# EAGLE design bldc-interface (EAGLE 6.2)
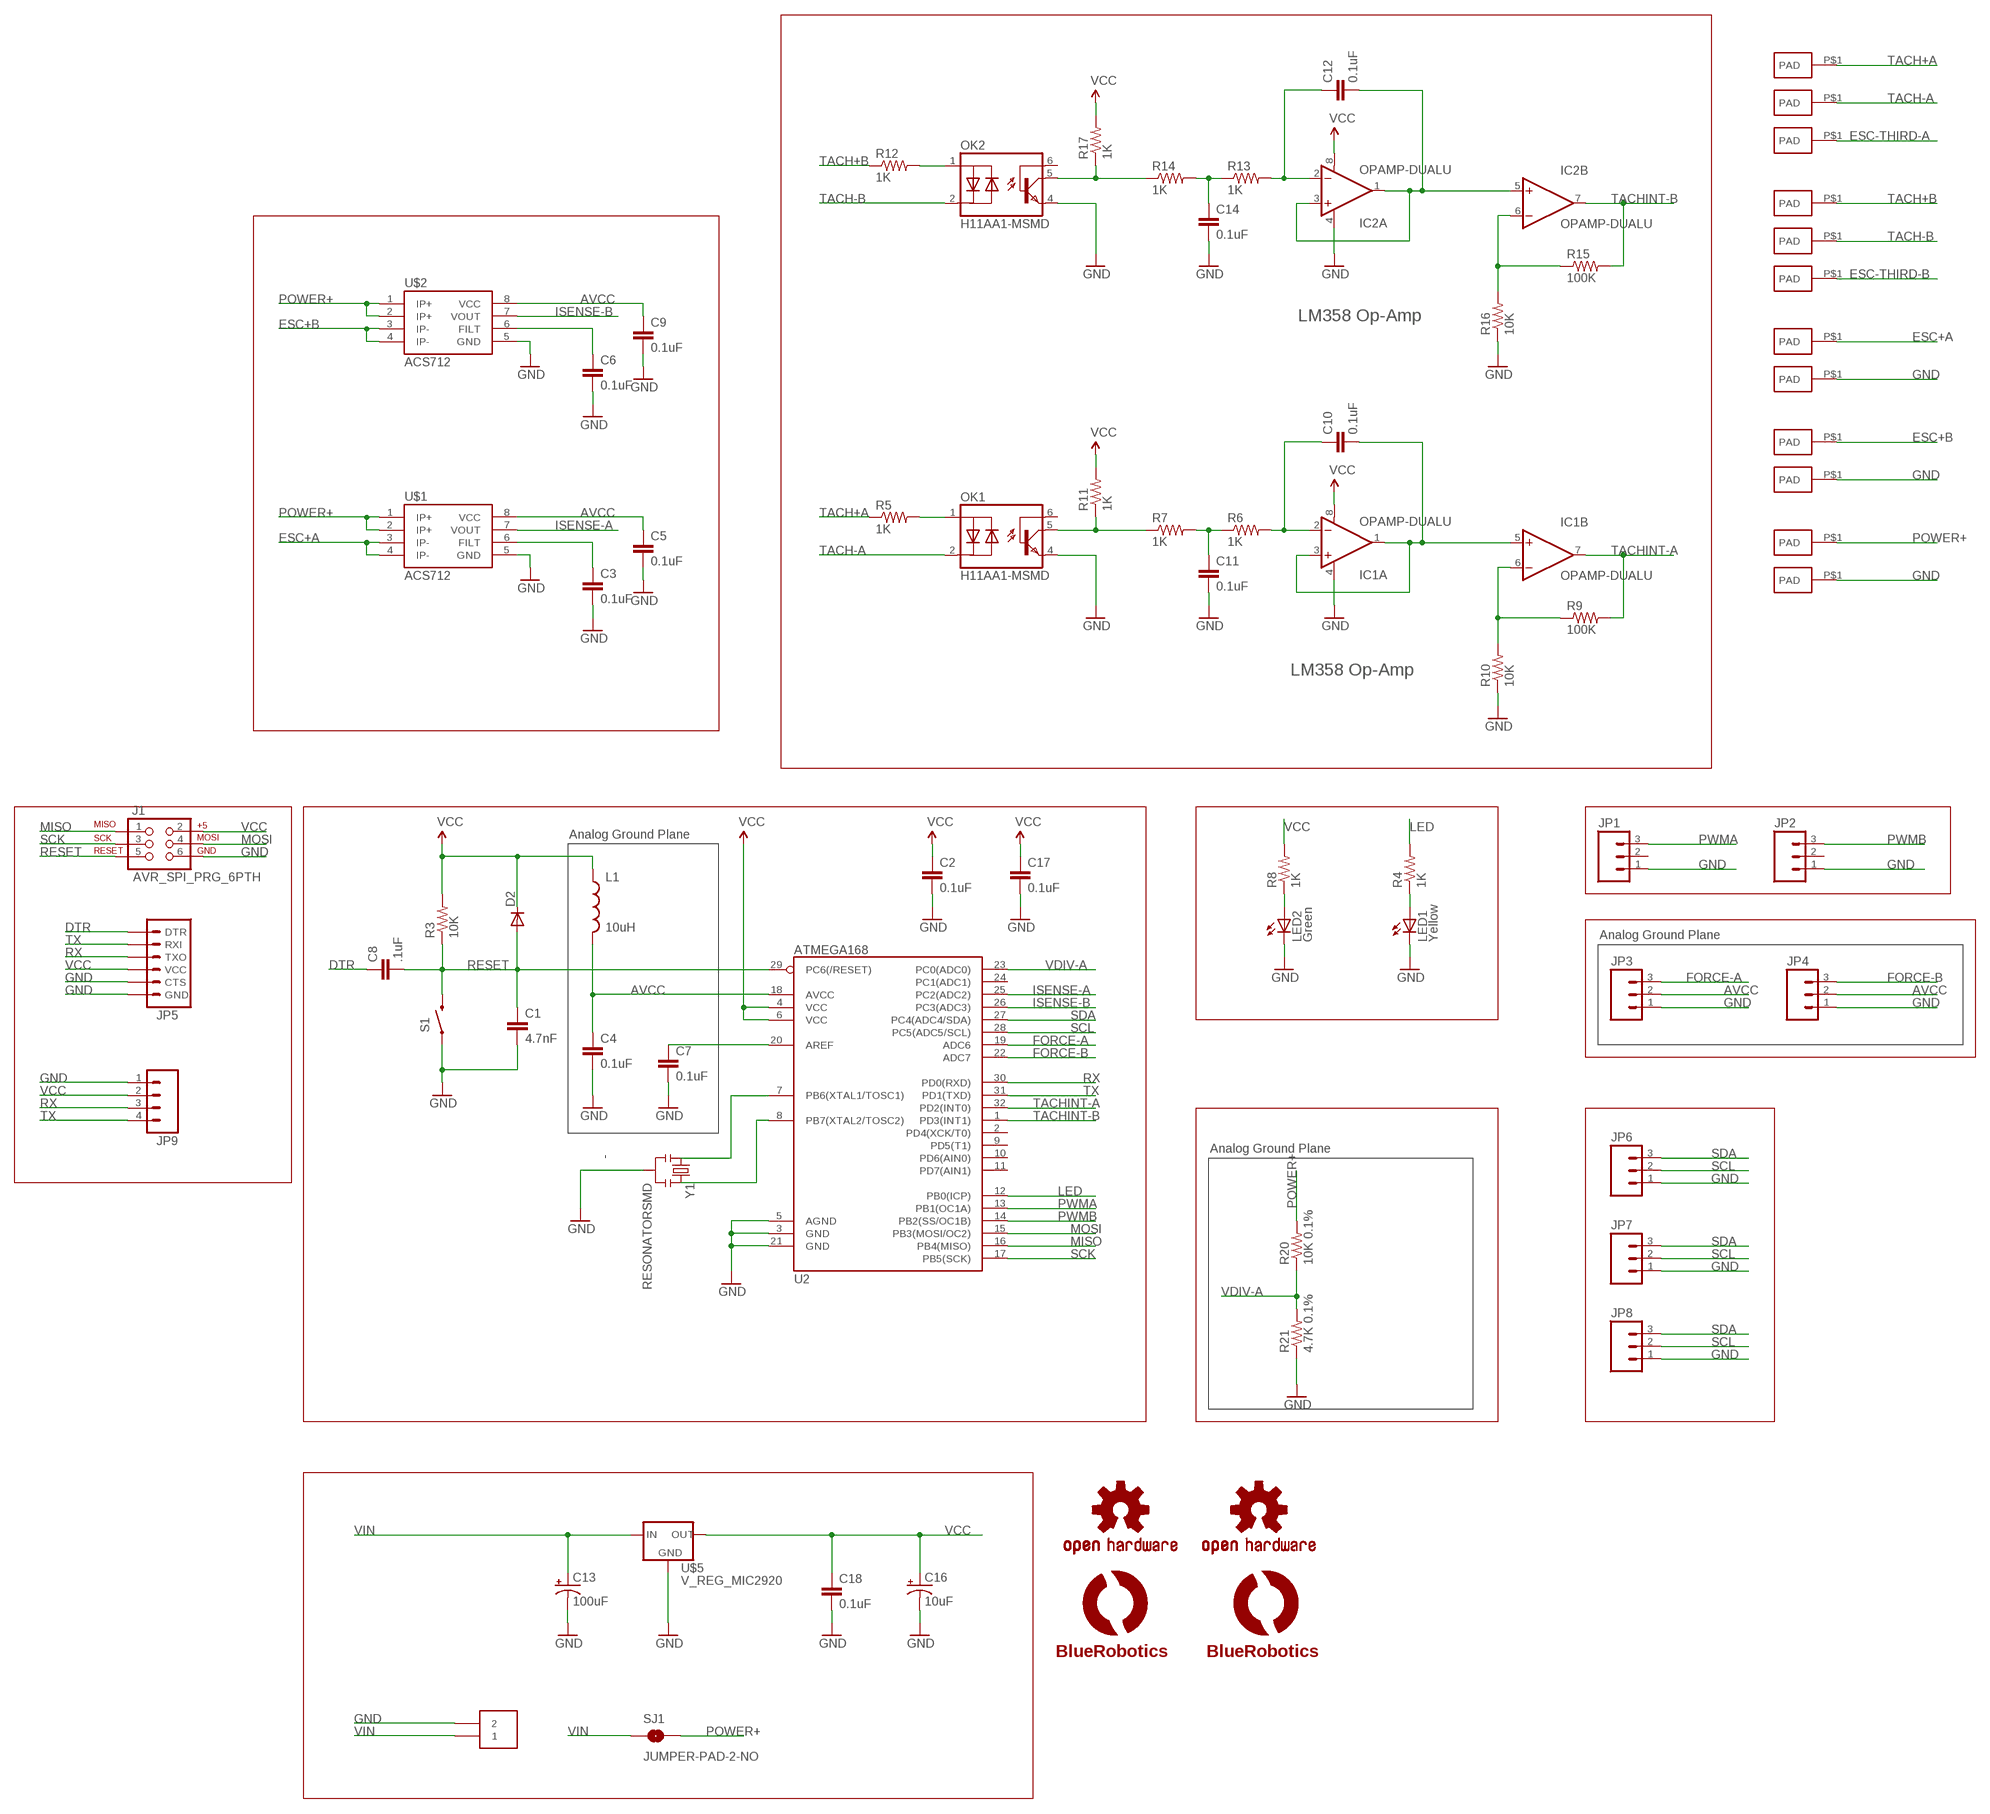
[diagram p0: schematic, sheet 1]

## Parts
C1  4.7nF  CAP0603-CAP  [0603-CAP]
C2  0.1uF  CAP0603-CAP  [0603-CAP]
C3  0.1uF  CAP0603-CAP  [0603-CAP]
C4  0.1uF  CAP0603-CAP  [0603-CAP]
C5  0.1uF  CAP0603-CAP  [0603-CAP]
C6  0.1uF  CAP0603-CAP  [0603-CAP]
C7  0.1uF  CAP0603-CAP  [0603-CAP]
C8  .1uF  CAP0603-CAP  [0603-CAP]
C9  0.1uF  CAP0603-CAP  [0603-CAP]
C10  0.1uF  CAP0603-CAP  [0603-CAP]
C11  0.1uF  CAP0603-CAP  [0603-CAP]
C12  0.1uF  CAP0603-CAP  [0603-CAP]
C13  100uF  CAP_POLPTH1  [CPOL-RADIAL-100UF-25V]
C14  0.1uF  CAP0603-CAP  [0603-CAP]
C16  10uF  CAP_POL1206  [EIA3216]
C17  0.1uF  CAP0603-CAP  [0603-CAP]
C18  0.1uF  CAP0603-CAP  [0603-CAP]
D2  DIODESOD  [SOD-323]
IC1  OPAMP-DUALU  [SO08]
IC2  OPAMP-DUALU  [SO08]
J1  AVR_SPI_PRG_6PTH  [2X3]
JP1  M03PTH  [1X03]
JP2  M03PTH  [1X03]
JP3  M03PTH  [1X03]
JP4  M03PTH  [1X03]
JP5  ARDUINO_SERIAL_PROGRAMPTH  [1X06]
JP6  M03PTH  [1X03]
JP7  M03PTH  [1X03]
JP8  M03PTH  [1X03]
JP9  M04PTH  [1X04]
L1  10uH  INDUCTOR0603  [0603]
LED1  Yellow  LED0603  [LED-0603]
LED2  Green  LED0603  [LED-0603]
LOGO1  OSHW-LOGOS  [OSHW-LOGO-S]
LOGO2  OSHW-LOGOM  [OSHW-LOGO-M]
OK1  H11AA1-MSMD  [DIL6-SMD]
OK2  H11AA1-MSMD  [DIL6-SMD]
R3  10K  RESISTOR0603-RES  [0603-RES]
R4  1K  RESISTOR0603-RES  [0603-RES]
R5  1K  RESISTOR2512  [R2512]
R6  1K  RESISTOR0603-RES  [0603-RES]
R7  1K  RESISTOR0603-RES  [0603-RES]
R8  1K  RESISTOR0603-RES  [0603-RES]
R9  100K  RESISTOR0603-RES  [0603-RES]
R10  10K  RESISTOR0603-RES  [0603-RES]
R11  1K  RESISTOR0603-RES  [0603-RES]
R12  1K  RESISTOR2512  [R2512]
R13  1K  RESISTOR0603-RES  [0603-RES]
R14  1K  RESISTOR0603-RES  [0603-RES]
R15  100K  RESISTOR0603-RES  [0603-RES]
R16  10K  RESISTOR0603-RES  [0603-RES]
R17  1K  RESISTOR0603-RES  [0603-RES]
R20  10K 0.1%  RESISTOR0603-RES  [0603-RES]
R21  4.7K 0.1%  RESISTOR0603-RES  [0603-RES]
S1  reset  SWITCH-MOMENTARY-2SMD  [TACTILE_SWITCH_SMD]
SJ1  JUMPER-PAD-2-NO  [PAD-JUMPER-2-NO_NO_SILK]
U2  ATMEGA168  [TQFP32-08]
U$1  ACS712  [SO08]
U$2  ACS712  [SO08]
U$3  TERMINAL-25MM-WEID  [LSF-SMT-5MM-2]
U$4  PADLARGE-ONE-SIDE  [PAD-0.2X0.3-ONE-SIDE]
U$5  V_REG_MIC2920  [SOT223]
U$6  PADLARGE-ONE-SIDE  [PAD-0.2X0.3-ONE-SIDE]
U$7  PADLARGE-ONE-SIDE  [PAD-0.2X0.3-ONE-SIDE]
U$8  PADLARGE-ONE-SIDE  [PAD-0.2X0.3-ONE-SIDE]
U$9  PADLARGE-ONE-SIDE  [PAD-0.2X0.3-ONE-SIDE]
U$10  PADLARGE-ONE-SIDE  [PAD-0.2X0.3-ONE-SIDE]
U$11  PADLARGE-ONE-SIDE  [PAD-0.2X0.3-ONE-SIDE]
U$12  PADLARGE-ONE-SIDE  [PAD-0.2X0.3-ONE-SIDE]
U$13  PADLARGE-ONE-SIDE  [PAD-0.2X0.3-ONE-SIDE]
U$14  PADLARGE-ONE-SIDE  [PAD-0.2X0.3-ONE-SIDE]
U$15  PADLARGE-ONE-SIDE  [PAD-0.2X0.3-ONE-SIDE]
U$16  PADLARGE-ONE-SIDE  [PAD-0.2X0.3-ONE-SIDE]
U$17  LOGOBR-LOGO-M  [BR-LOGO-MEDIUM]
U$18  LOGOBR-LOGO-S  [BR-LOGO-SMALL]
Y1  RESONATORSMD  [RESONATOR-SMD]

## Nets
AVCC: C4.1 C5.1 C9.1 JP3.2 JP4.2 L1.2 U2.18(AVCC) U$1.8(VCC) U$2.8(VCC)
DTR: C8.1 JP5.1(DTR)
ESC+A: U$1.3(IP-) U$1.4(IP-) U$13.P$1(PAD)
ESC+B: U$2.3(IP-) U$2.4(IP-) U$15.P$1(PAD)
ESC-THIRD-A: U$9.P$1(PAD)
ESC-THIRD-B: U$12.P$1(PAD)
FORCE-A: JP3.3 U2.19(ADC6)
FORCE-B: JP4.3 U2.22(ADC7)
GND: C1.2 C2.2 C3.2 C4.2 C5.2 C6.2 C7.2 C9.2 C11.2 C13.2(-) C14.2 C16.C(-) C17.2 C18.2 IC1.4(A:V-) IC2.4(A:V-) J1.6 JP1.1 JP2.1 JP3.1 JP4.1 JP5.5(CTS) JP5.6(GND) JP6.1 JP7.1 JP8.1 JP9.1 LED1.C LED2.C OK1.4(EMI) OK2.4(EMI) R10.1 R16.1 R21.1 S1.1 U2.3(GND) U2.5(AGND) U2.21(GND) U$1.5(GND) U$2.5(GND) U$3.2 U$3.4 U$5.2(GND) U$8.P$1(PAD) U$14.P$1(PAD) U$16.P$1(PAD) Y1.2
ISENSE-A: U2.25(PC2(ADC2)) U$1.7(VOUT)
ISENSE-B: U2.26(PC3(ADC3)) U$2.7(VOUT)
LED: R4.2 U2.12(PB0(ICP))
MISO: J1.1 U2.16(PB4(MISO))
MOSI: J1.4 U2.15(PB3(MOSI/OC2))
N$1: C6.1 U$2.6(FILT)
N$2: C3.1 U$1.6(FILT)
N$3: LED1.A R4.1
N$4: C10.1 IC1.2(A:-IN) R6.2
N$6: C10.2 IC1.1(A:OUT) IC1.3(A:+IN) IC1.5(B:+IN)
N$7: IC1.6(B:-IN) R9.1 R10.2
N$8: C11.1 R6.1 R7.2
N$9: C7.1 U2.20(AREF)
N$10: U2.7(PB6(XTAL1/TOSC1)) Y1.1
N$11: U2.8(PB7(XTAL2/TOSC2)) Y1.3
N$12: OK1.5(COL) R7.1 R11.1
N$13: C12.1 IC2.2(A:-IN) R13.2
N$14: OK1.1(A) R5.2
N$15: C12.2 IC2.1(A:OUT) IC2.3(A:+IN) IC2.5(B:+IN)
N$16: LED2.A R8.1
N$17: C14.1 R13.1 R14.2
N$18: IC2.6(B:-IN) R15.1 R16.2
N$19: OK2.1(A) R12.2
N$20: OK2.5(COL) R14.1 R17.1
POWER+: R20.2 SJ1.2 U$1.1(IP+) U$1.2(IP+) U$2.1(IP+) U$2.2(IP+) U$7.P$1(PAD)
PWMA: JP1.3 U2.13(PB1(OC1A))
PWMB: JP2.3 U2.14(PB2(SS/OC1B))
RESET: C1.1 C8.2 D2.2(A) J1.5 R3.1 S1.3 U2.29(PC6(/RESET))
RX: JP5.3(TXO) JP9.3 U2.30(PD0(RXD))
SCK: J1.3 U2.17(PB5(SCK))
SCL: JP6.2 JP7.2 JP8.2 U2.28(PC5(ADC5/SCL))
SDA: JP6.3 JP7.3 JP8.3 U2.27(PC4(ADC4/SDA))
TACH+A: R5.1 U$6.P$1(PAD)
TACH+B: R12.1 U$10.P$1(PAD)
TACH-A: OK1.2(C) U$4.P$1(PAD)
TACH-B: OK2.2(C) U$11.P$1(PAD)
TACHINT-A: IC1.7(B:OUT) R9.2 U2.32(PD2(INT0))
TACHINT-B: IC2.7(B:OUT) R15.2 U2.1(PD3(INT1))
TX: JP5.2(RXI) JP9.4 U2.31(PD1(TXD))
VCC: C2.1 C16.A(+) C17.1 C18.1 D2.1(C) IC1.8(A:V+) IC2.8(A:V+) J1.2 JP5.4(VCC) JP9.2 L1.1 R3.2 R8.2 R11.2 R17.2 U2.4(VCC) U2.6(VCC) U$5.3(OUT)
VDIV-A: R20.1 R21.2 U2.23(PC0(ADC0))
VIN: C13.1(+) SJ1.1 U$3.1 U$3.3 U$5.1(IN)
Unconnected: JP1.2 JP2.2 OK1.6(BAS) OK2.6(BAS) U2.2(PD4(XCK/T0)) U2.9(PD5(T1)) U2.10(PD6(AIN0)) U2.11(PD7(AIN1)) U2.24(PC1(ADC1))

## Notes on the sheet
- LM358 Op-Amp
- LM358 Op-Amp
- Analog Ground Plane
- Analog Ground Plane
- Analog Ground Plane

## Library data of the parts
C1 C4 C7 C8 C18 = SparkFun:CAP: Capacitor Standard 0603 ceramic capacitor, and 0.1" leaded capacitor.
C2 C17 = SparkFun2:CAP: Capacitor Standard 0603 ceramic capacitor, and 0.1" leaded capacitor.
C3 C5 C6 C9-C12 C14 = SparkFun-Capacitors:CAP: Capacitor Standard 0603 ceramic capacitor, and 0.1" leaded capacitor.
C13 C16 = SparkFun:CAP_POL: Capacitor Polarized These are standard SMD and PTH capacitors. Normally 10uF, 47uF, and 100uF in electrolytic and tantalum varieties. Always verify the external diameter of the through hole cap, it varies with capacity, voltage, and manufacturer. The EIA devices should be standard.
D2 = SparkFun:DIODE: Diode These are standard reverse protection diodes and small signal diodes. SMA package can handle up to about 1A. SOD-323 can handle about 200mA. What the SOD-323 package when ordering, there are some mfgs out there that are 5-pin packages.
IC1 IC2 = SparkFun-AnalogIC:OPAMP-DUAL: Generic op-amp footprint
J1 = SparkFun:AVR_SPI_PRG_6: AVR ISP 6 Pin This is the reduced ISP connector for AVR programming. Common on Arduino. This footprint will take up less PCB space and can be used with a 10-pin to 6-pin adapter such as SKU: BOB-08508
JP1-JP4 JP6-JP8 = SparkFun:M03: Header 3 Standard 3-pin 0.1" header. Use with straight break away headers (SKU : PRT-00116), right angle break away headers (PRT-00553), swiss pins (PRT-00743), machine pins (PRT-00117), and female headers (PRT-00115). Molex polarized connector foot print use with SKU : PRT-08232 with associated crimp pins and housings.
JP5 = SparkFun:ARDUINO_SERIAL_PROGRAM
JP9 = SparkFun-Connectors:M04: Header 4 Standard 4-pin 0.1" header. Use with straight break away headers (SKU : PRT-00116), right angle break away headers (PRT-00553), swiss pins (PRT-00743), machine pins (PRT-00117), and female headers (PRT-00115). Molex polarized connector foot print use with SKU : PRT-08231 with associated crimp pins and housings. 1MM SMD Version SKU: PRT-10208
L1 = SparkFun:INDUCTOR: Inductors Basic Inductor/Choke - 0603 and 1206. Footprints are not proven and vary greatly between part numbers.
LED1 LED2 = SparkFun:LED: LEDs Standard schematic elements and footprints for 5mm, 3mm, 1206, and 0603 sized LEDs. 5mm - Spark Fun Electronics SKU : COM-00529 (and others)
LOGO1 LOGO2 = SparkFun-Aesthetics:OSHW-LOGO: Open Source Hardware Logo This logo indicates the piece of hardware it is found on incorporates a OSHW license and/or adheres to the definition of open source hardware found here: http://freedomdefined.org/OSHW
OK1 OK2 = AT-Parts-RJ:H11AA1-M: MOTOROLA OPTO COUPLER
R3 R4 R8 R20 R21 = SparkFun:RESISTOR: Resistor Basic schematic elements and footprints for 0603, 1206, and PTH resistors.
R5-R7 R9-R17 = SparkFun-Resistors:RESISTOR: Resistor Basic schematic elements and footprints for 0603, 1206, and PTH resistors.
S1 = SparkFun:SWITCH-MOMENTARY-2
SJ1 = SparkFun-Passives:JUMPER-PAD-2-NO
U2 = SparkFun:ATMEGA168
U$1 U$2 = SparkFun-AnalogIC:ACS712: Hall-effect-based isolated linear current sensor
U$3 = AT-Parts-RJ:TERMINAL-2
U$4 U$6-U$16 = AT-Parts-RJ:PAD
U$5 = SparkFun:V_REG_MIC2920: MIC2920A (http://www.micrel.com/_PDF/mic2920.pdf) - 400mA output LDO Regulator
U$17 U$18 = BR-Eagle-Library:LOGO
Y1 = SparkFun:RESONATOR: Resonator Small SMD resonator. This is the itty bitty 10/20MHz resonators with built in caps. CSTCE10M0G55 and CSTCE20M0V53. Footprint has been reviewed closely but hasn't been tested yet.

## Board
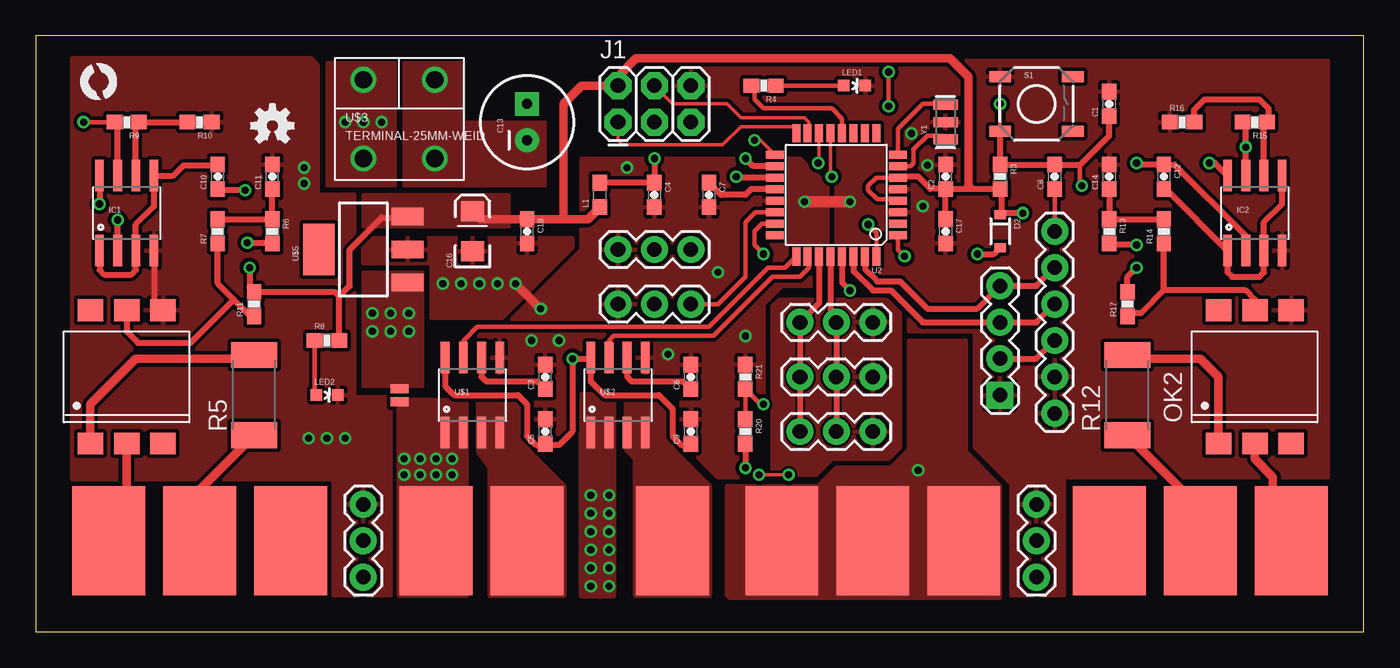
[diagram p1: board, top side]
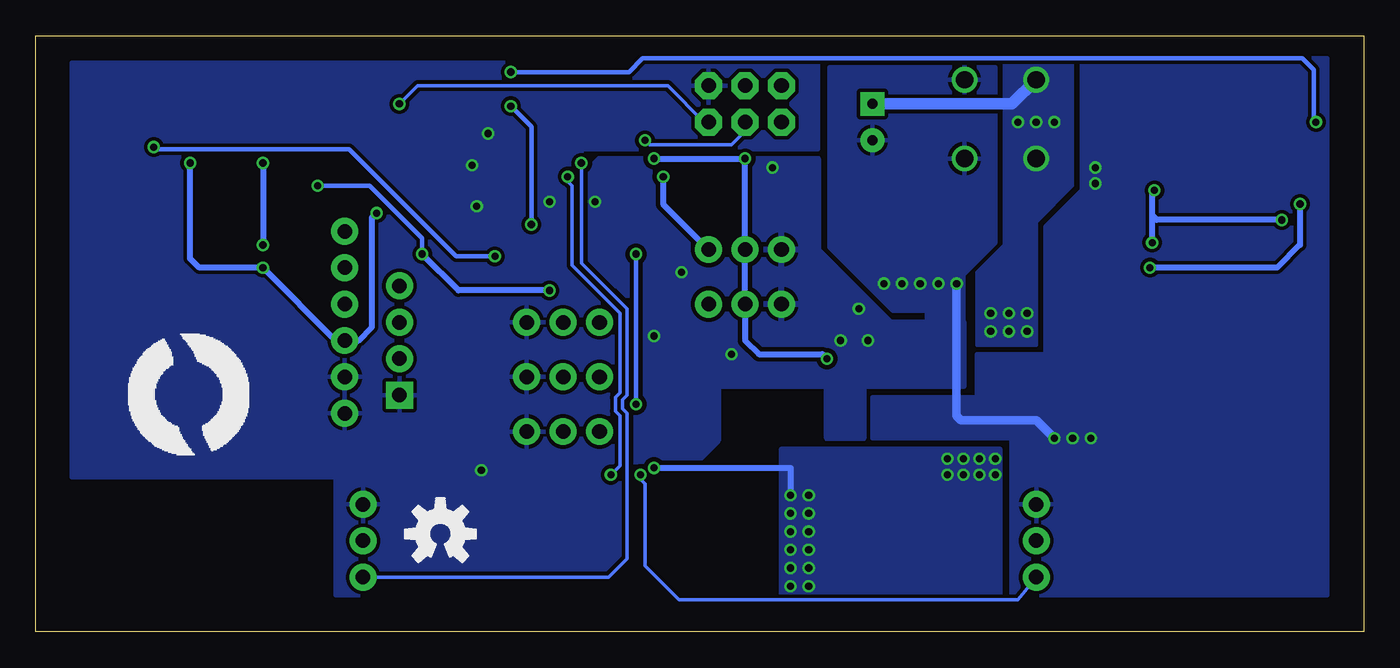
[diagram p2: board, bottom side, seen from below]

Size 92.69 x 41.58 mm. Coordinates in mm from the lower left corner, seen from the top.
Outline: 0,0 92.69,0 92.69,41.58 0,41.58 0,0
Copper layers (1*16): Top 0.0356mm / dielectric 1.5011mm / Bottom 0.0356mm
Design rules "default": minimum track width 6mil, minimum drill 13mil, track to track 6mil, track to pad 6mil, pad to pad 6mil, via to via 6mil, smd to smd 6mil, copper to edge 15mil, drill to drill 6mil, minimum pad ring 7mil, minimum via ring 7mil, stop-mask expansion 3mil, vias tented up to drill 0mil, thermal gap 10mil

### Footprints (pad centres in the part's own frame; a part is rotated, then mirrored left to right if it is on the bottom)
0603-CAP = smd 1.1 x 1: 1 -0.85,0; 2 0.85,0
CPOL-RADIAL-100UF-25V = drill 0.7 pad 1.651 square: 1 1.27,0 | drill 0.7 pad 1.651: 2 -1.27,0
EIA3216 = smd 1.4 x 1.6: A 1.4,0; C -1.4,0
SOD-323 = smd 0.63 x 0.83: 1 -1.15,0; 2 1.15,0
SO08 = smd 0.61 x 2.21: 1 -1.905,-2.616; 2 -0.635,-2.616; 3 0.635,-2.616; 4 1.905,-2.616; 5 1.905,2.616; 6 0.635,2.616; 7 -0.635,2.616; 8 -1.905,2.616
2X3 = drill 1.016 pad 1.88 octagon: 1 0,0; 2 0,2.54; 3 2.54,0; 4 2.54,2.54; 5 5.08,0; 6 5.08,2.54
1X03 = drill 1.016 pad 1.88: 1 0,0; 2 2.54,0; 3 5.08,0
1X06 = drill 1.016 pad 1.88: 1 0,0; 2 2.54,0; 3 5.08,0; 4 7.62,0; 5 10.16,0; 6 12.7,0
1X04 = drill 1.016 pad 1.88 square: 1 0,0 | drill 1.016 pad 1.88: 2 2.54,0; 3 5.08,0; 4 7.62,0
0603 = smd 1.1 x 1: 1 -0.85,0; 2 0.85,0
LED-0603 = smd 0.8 x 0.8: A 0,-0.75; C 0,0.75
DIL6-SMD = smd 1.78 x 1.52: 1 -2.54,-4.645; 2 0,-4.645; 3 2.54,-4.645; 4 2.54,4.645; 5 0,4.645; 6 -2.54,4.645
0603-RES = smd 1.1 x 1: 1 -0.85,0; 2 0.85,0
R2512 = smd 1.8 x 3.2: 1 -2.8,0; 2 2.8,0
TACTILE_SWITCH_SMD = smd 1.524 x 0.762: 1 -2.54,1.905; 2 2.54,1.905; 3 -2.54,-1.905; 4 2.54,-1.905
PAD-JUMPER-2-NO_NO_SILK = smd 0.635 x 1.27: 1 -0.45,0; 2 0.45,0
TQFP32-08 = smd 1.27 x 0.559: 1 -4.293,2.8; 2 -4.293,2; 3 -4.293,1.2; 4 -4.293,0.4; 5 -4.293,-0.4; 6 -4.293,-1.2; 7 -4.293,-2; 8 -4.293,-2.8; 17 4.293,-2.8; 18 4.293,-2; 19 4.293,-1.2; 20 4.293,-0.4; 21 4.293,0.4; 22 4.293,1.2; 23 4.293,2; 24 4.293,2.8 | smd 0.559 x 1.27: 9 -2.8,-4.293; 10 -2,-4.293; 11 -1.2,-4.293; 12 -0.4,-4.293; 13 0.4,-4.293; 14 1.2,-4.293; 15 2,-4.293; 16 2.8,-4.293; 25 2.8,4.293; 26 2,4.293; 27 1.2,4.293; 28 0.4,4.293; 29 -0.4,4.293; 30 -1.2,4.293; 31 -2,4.293; 32 -2.8,4.293
LSF-SMT-5MM-2 = drill 1.2: 1 0,0; 2 5,0; 3 0,5.5; 4 5,5.5
PAD-0.2X0.3-ONE-SIDE = smd 5.08 x 7.62: P$1 0,0
SOT223 = smd 1.219 x 2.235: 1 -2.311,-3.099; 2 0,-3.099; 3 2.311,-3.099 | smd 3.6 x 2.2: 4 0,3.099
RESONATOR-SMD = smd 0.7 x 1.7: 1 -1.2,0; 2 0,0; 3 1.2,0

### Placement (x,y rotation side)
C1  74.93,36.83 90 top
C2  63.5,31.75 90 top
C3  35.56,17.78 90 top
C4  43.18,30.48 270 top
C5  35.56,13.97 90 top
C6  45.72,17.78 90 top
C7  46.99,30.48 270 top
C8  71.12,31.75 90 top
C9  45.72,13.97 90 top
C10  12.7,31.75 90 top
C11  16.51,31.75 90 top
C12  78.74,31.75 270 top
C13  34.29,35.56 90 top
C14  74.93,31.75 90 top
C16  30.48,27.94 90 top
C17  63.5,27.94 270 top
C18  34.29,27.94 270 top
D2  67.31,27.94 270 top
IC1  6.35,29.21 0 top
IC2  85.09,29.21 0 top
J1  40.64,35.56 0 top
JP1  22.86,8.89 270 top
JP2  69.85,8.89 270 top
JP3  40.64,26.67 0 top
JP4  40.64,22.86 0 top
JP5  71.12,27.94 270 top
JP6  58.42,21.59 180 top
JP7  58.42,17.78 180 top
JP8  58.42,13.97 180 top
JP9  67.31,16.51 90 top
L1  39.37,30.48 90 top
LED1  57.15,38.1 270 top
LED2  20.32,16.51 270 top
LOGO1  16.52,35.31 0 top
LOGO2  64.45,6.83 0 bottom
OK1  6.35,17.78 0 top
OK2  85.09,17.78 0 top
R3  67.31,31.75 270 top
R4  50.8,38.1 180 top
R5  15.24,16.51 90 top
R6  16.51,27.94 270 top
R7  12.7,27.94 90 top
R8  20.32,20.32 0 top
R9  6.35,35.56 180 top
R10  11.43,35.56 180 top
R11  15.24,22.86 90 top
R12  76.2,16.51 90 top
R13  74.93,27.94 270 top
R14  78.74,27.94 90 top
R15  85.09,35.56 180 top
R16  80.01,35.56 0 top
R17  76.2,22.86 90 top
R20  49.53,13.97 270 top
R21  49.53,17.78 270 top
S1  69.85,36.83 0 top
SJ1  25.4,16.51 270 top
U2  55.88,30.48 180 top
U$1  30.48,16.51 0 top
U$2  40.64,16.51 0 top
U$3  22.86,33.02 0 top
U$4  5.08,6.35 0 top
U$5  22.86,26.67 90 top
U$6  11.43,6.35 0 top
U$7  27.94,6.35 0 top
U$8  52.07,6.35 0 top
U$9  17.78,6.35 180 top
U$10  81.28,6.35 180 top
U$11  87.63,6.35 180 top
U$12  74.93,6.35 180 top
U$13  34.29,6.35 180 top
U$14  58.42,6.35 180 top
U$15  44.45,6.35 0 top
U$16  64.77,6.35 0 top
U$17  86.21,12.37 0 bottom
U$18  3.12,37.13 0 top
Y1  63.5,35.56 90 top

### Tracks (layer width: path | path; a pad name or v marks a point on that pad's centre or on a via)
AVCC  (via drill 0.5)
  Top 0.406: U2.18 50.07,32.48 v49.53,33.02 | v43.18,33.02 C4.1 L1.2 | U$1.8 28.57,17.14 29.21,16.51 33.66,16.51 34.29,15.88 34.29,13.65 34.92,13.02 35.46,13.02 C5.1 35.66,13.02 36.51,13.02 37.47,13.97 v37.47,19.05 38.66,19.05 U$2.8 38.73,17.46 39.69,16.51 43.5,16.51 44.45,15.56 44.45,13.65 45.09,13.02 45.62,13.02 C9.1
  Bottom 0.406: v49.53,33.02 v43.18,33.02 JP3.2 JP4.2 43.18,20.32 42.23,19.37 37.78,19.37 v37.47,19.05
DTR
  Top 0.305: C8.1 JP5.1
ESC+A
  pour Top (isolate 0.254, no thermals): 31.75,2.54 31.75,11.43 30.96,12.54 30.96,16.35 34.29,16.51 34.29,12.7 36.83,10.16 36.83,2.54
ESC+B
  pour Top (isolate 0.254, no thermals): 41.91,2.54 41.91,12.06 41.27,12.7 41.27,16.51 44.45,16.51 44.45,12.7 46.99,10.16 46.99,2.54
FORCE-A  (via drill 0.5)
  Top 0.406: U2.19 48.97,31.68 v48.9,31.75
  Bottom 0.406: v48.9,31.75 48.9,29.84 JP3.3
FORCE-B
  Top 0.305: U2.22 50.23,29.28 49.53,28.57 49.53,24.77 47.62,22.86 JP4.3
GND  (via drill 0.5)
  Top 0.406: IC1.4 8.26,23.06 OK1.4
  Top 0.61: v33.5,24.29 v35.24,22.54
  Top 0.813: v53.66,30 v56.83,30
  Bottom 0.61: v28.42,24.29 28.42,15.08 28.1,14.76 22.86,14.76 v21.59,13.49
  other vias: 34.61,20.32 36.51,20.32 44.13,19.37 49.53,20.64 47.62,25.08 41.27,32.38 29.69,24.29 30.96,24.29 32.23,24.29 19.05,13.49 20.32,13.49 61.59,11.27 61.91,29.69 62.23,32.54 61.12,34.77 18.73,32.38 18.73,31.27
  pour Top (isolate 0.254): 38.1,33.02 38.1,26.67 33.02,21.59 27.94,21.59 27.94,17.14 34.92,17.14 34.92,13.34 37.47,10.79 37.47,17.14 45.09,17.14 45.09,13.34 47.62,10.79 50.8,10.79 50.8,22.86 52.07,24.13 55.24,24.13 55.24,31.11 53.34,33.02
  pour Bottom (isolate 0.305): 38.1,33.02 38.1,26.67 33.02,21.59 27.94,21.59 27.94,17.14 34.92,17.14 34.92,13.49 37.47,13.49 37.47,17.14 45.09,17.14 45.09,13.34 47.62,10.79 50.8,10.79 50.8,22.86 52.07,24.13 55.24,24.13 55.24,31.11 53.34,33.02
  pour Top (isolate 0.254, no thermals): 25.72,39.69 29.84,39.69 29.84,35.56 35.56,35.56 35.56,31.11 25.72,31.11
  pour Top (isolate 0.254, no thermals): 48.26,2.54 48.26,10.16 52.39,10.16 54.61,10.16 55.88,11.43 59.69,11.43 60.96,12.7 60.96,20.32 64.93,20.32 64.93,12.54 67.31,10.16 67.31,2.38 48.42,2.38
  pour Top: 51.44,10.95 54.45,10.95 55.56,12.06 59.53,12.06 60.33,12.86 60.33,22.23 59.37,23.18 51.91,23.18 51.44,22.7
  pour Top (isolate 0.254): 68.1,2.54 71.75,2.54 71.75,10.79 90.17,10.79 90.17,39.85 38.1,39.85 38.1,33.66 55.24,33.66 55.88,33.02 55.88,24.13 59.37,24.13 60.96,22.38 60.96,20.95 65.56,20.95 65.56,12.86 68.1,10.32
  pour Top (isolate 0.254): 24.77,2.54 20.8,2.54 20.8,10.64 2.54,10.64 2.54,40.01 19.21,40.01 19.68,39.53 19.68,30.48 22.23,30.48 22.23,16.35 24.77,16.35
  pour Top (isolate 0.254): 22.86,25.72 22.86,27.46 37.47,27.46 37.47,26.83 32.54,21.91 27.62,21.91 27.62,25.72
  pour Bottom (isolate 0.254): 2.54,40.01 19.68,40.01 19.68,30.8 22.23,28.26 22.23,19.37 26.99,19.37 26.99,16.35 34.29,16.35 34.29,13.49 24.61,13.49 24.61,2.54 2.54,2.54
  pour Bottom (isolate 0.254): 25.72,39.37 37.31,39.37 37.31,26.83 32.86,22.38 30.48,22.38 30.48,21.75 27.94,21.75 27.94,24.92 25.72,27.15
  pour Bottom (isolate 0.254): 48.26,2.54 48.26,10.16 51.44,10.16 51.44,22.54 54.61,25.72 54.61,33.66 38.1,33.66 38.1,39.69 90.17,39.69 90.17,10.79 71.75,10.79 71.75,2.54
ISENSE-A
  Top 0.305: U$1.7 29.84,20.32 30.8,21.27 46.99,21.27 51.12,25.4 52.29,25.4 U2.25
ISENSE-B
  Top 0.305: U$2.7 40.01,20.32 40.32,20.64 47.31,20.64 51.44,24.77 53.34,24.77 53.98,25.4 53.98,26.09 U2.26
LED
  Top 0.305: U2.12 56.28,35.8 55.56,36.51 50.8,36.51 50.16,37.15 50.16,37.88 R4.2
MISO
  Top 0.254: J1.1 40.64,34.29 40.96,33.97 47.94,33.97 49.21,35.24 52.93,35.24 U2.16
MOSI
  Top 0.254: J1.4 44.45,36.83 48.26,36.83 49.21,35.88 53.66,35.88 53.98,35.56 53.98,34.87 U2.15
N$1
  Top 0.406: U$2.6 41.27,17.78 41.59,17.46 45.19,17.46 C6.1
N$2
  Top 0.406: U$1.6 31.11,17.78 31.43,17.46 35.03,17.46 C3.1
N$3
  Top 0.305: R4.1 LED1.A
N$4  (via drill 0.5)
  Top 0.406: R6.2 14.82,27.09 v14.76,27.15 | v14.61,30.8 12.8,30.8 C10.1 | IC1.2 v5.71,28.73
  Bottom 0.406: v14.76,27.15 14.76,29.05 | 14.76,29.05 14.76,30.64 v14.61,30.8 | v5.71,28.73 14.45,28.73 14.76,29.05
N$6
  Top 0.406: IC1.1 4.45,25.24 4.76,24.92 6.67,24.92 6.99,25.24 IC1.3 6.99,28.42 8.26,29.69 IC1.5 9.6,31.83 10.32,32.54 12.64,32.54 C10.2
N$7
  Top 0.406: IC1.6 6.99,35.34 R9.1 R10.2
N$8
  Top 0.406: R7.2 R6.1 C11.1
N$9
  Top 0.406: 47.44,30.88 C7.1 47.84,30.48 49.53,30.48 49.93,30.88 U2.20
N$10
  Top 0.305: U2.7 61.05,32.48 61.28,32.7 61.28,33.66 62.23,34.61 63.25,34.61 Y1.1
N$11
  Top 0.305: U2.8 60.17,35.09 61.91,36.83 63.43,36.83 Y1.3
N$12
  Top 0.406: R7.1 12.7,24.29 13.81,23.18 | R11.1 14.98,22.01 13.81,23.18 | OK1.5 6.35,20.95 7.14,20.16 10.79,20.16 13.81,23.18
N$13  (via drill 0.5)
  Top 0.406: v76.83,32.7 76.94,32.6 C12.1 79.48,32.6 84.45,27.62 IC2.2 | v76.83,26.99 75.03,26.99 R13.2
  Bottom 0.406: v76.83,32.7 v76.83,26.99
N$14
  Top 0.61: OK1.1 3.81,15.88 6.99,19.05 14.98,19.05 R5.2
N$15
  Top 0.406: C12.2 78.88,30.9 IC2.1 83.19,25.08 83.5,24.77 85.41,24.77 85.72,25.08 IC2.3 85.72,28.57 87,29.84 IC2.5
N$16
  Top 0.305: R8.1 19.47,16.61 LED2.A
N$17
  Top 0.406: C14.1 R13.1 R14.2
N$18
  Top 0.406: IC2.6 85.72,35.34 R15.1 86.04,35.66 86.04,36.51 85.41,37.15 81.6,37.15 80.86,36.41 R16.2
N$19
  Top 0.61: OK2.1 82.55,17.78 81.28,19.05 76.46,19.05 R12.2
N$20
  Top 0.406: OK2.5 85.09,23.18 84.45,23.81 78.74,23.81 | 78.74,23.81 77.15,22.23 76.42,22.23 R17.1 | 78.74,23.81 R14.1
POWER+  (via drill 0.5)
  Top 0.406: R20.2 v49.53,11.43
  Bottom 0.406: v49.53,11.43 40.01,11.43 v40.01,9.53
  other vias: 25.72,12.06 26.83,12.06 27.94,12.06 29.05,12.06 38.73,9.53 40.01,8.26 38.73,6.99 38.73,5.71 38.73,4.45 38.73,3.17 40.01,3.17 40.01,4.45 40.01,5.71 40.01,6.99 25.72,10.95 26.83,10.95 27.94,10.95 29.05,10.95 38.73,8.26
  pour Top (isolate 0.254, no thermals): 25.4,2.54 25.4,16.19 30,16.12 30,2.54
  pour Bottom (isolate 0.254, no thermals): 25.4,12.7 40.64,12.7 40.64,2.54 25.4,2.54
  pour Top (isolate 0.254, no thermals): 40.32,2.54 40.32,16.51 38.1,16.51 38.1,2.54
PWMA  (via drill 0.5)
  Top 0.254: U2.13 55.48,31.83 v55.56,31.75 | v52.55,10.95 v50.48,10.95
  Bottom 0.254: v55.56,31.75 55.56,31.43 55.24,31.11 55.24,25.56 51.91,22.23 51.91,16.67 52.23,16.35 52.23,15.4 51.91,15.08 51.91,11.59 v52.55,10.95 | v50.48,10.95 50.48,10.64 50.16,10.32 50.16,4.6 47.78,2.22 24.13,2.22 JP1.3
PWMB  (via drill 0.5)
  Top 0.254: U2.14 54.68,32.77 v54.61,32.7
  Bottom 0.254: v54.61,32.7 54.61,25.72 51.44,22.54 51.44,16.51 51.75,16.19 51.75,15.56 51.44,15.24 51.44,5.08 52.7,3.81 JP2.3
RESET  (via drill 0.5)
  Top 0.254: v67.31,36.83 S1.3
  Top 0.305: R3.1 72.81,32.6 72.87,32.54 72.87,31.27 v73.03,31.11
  Top 0.406: U2.29 56.28,24.36 v56.83,23.81 | v65.72,26.35 66.87,26.35 D2.2 | S1.3 R3.1 C8.2 72.92,32.6 74.93,34.61 C1.1
  Bottom 0.254: J1.5 46.04,35.56 48.58,38.1 66.04,38.1 v67.31,36.83
  Bottom 0.305: v73.03,31.11 69.37,31.11 65.72,27.46 v65.72,26.35
  Bottom 0.406: v56.83,23.81 63.18,23.81 v65.72,26.35
RX
  Top 0.406: U2.30 57.08,25.15 58.42,23.81 59.69,23.81 61.91,21.59 JP9.3 69.85,21.59 JP5.3
SCK  (via drill 0.5)
  Top 0.254: v50.16,34.29 50.58,34.29 U2.17
  Bottom 0.254: J1.3 43.18,34.92 44.13,33.97 49.85,33.97 v50.16,34.29
SCL
  Top 0.406: U2.28 55.48,21.99 JP6.2 JP7.2 JP8.2
SDA
  Top 0.406: U2.27 54.68,22.93 JP6.3 JP7.3 JP8.3
TACH+A
  Top 0.61: U$6.P$1 11.43,9.9 R5.1
TACH+B
  Top 0.61: U$10.P$1 81.28,8.63 R12.1
TACH-A
  Top 0.61: U$4.P$1 6.35,6.35 OK1.2
TACH-B
  Top 0.61: OK2.2 85.09,12.06 86.36,10.79 86.36,7.62 U$11.P$1
TACHINT-A  (via drill 0.5)
  Top 0.305: U2.32 58.68,27.84 v58.1,28.42 | v59.53,36.67 v59.53,39.05 | 5.56,35.62 R9.2 v3.33,35.56
  Top 0.406: IC1.7 5.71,35.34 R9.2
  Bottom 0.305: v58.1,28.42 58.1,35.24 v59.53,36.67 | v59.53,39.05 51.28,39.05 50.32,40.01 4.29,40.01 3.49,39.21 3.49,35.72 v3.33,35.56
TACHINT-B  (via drill 0.5)
  Top 0.305: U2.1 60.17,26.66 v60.64,26.19
  Top 0.406: IC2.7 v84.45,33.81 84.45,35.34 R15.2
  Bottom 0.305: v60.64,26.19 63.34,26.19 70.8,33.66 84.3,33.66 v84.45,33.81
TX
  Top 0.406: U2.31 57.88,25.3 58.74,24.45 60.33,24.45 62.23,22.54 65.72,22.54 JP9.4 69.85,24.13 JP5.2
VCC  (via drill 0.5)
  Top 0.305: U2.6 58.67,31.68 58.1,31.11 58.1,30.8 58.74,30.16 60.09,30.16 U2.4
  Top 0.406: v68.9,29.21 67.43,29.21 | 67.43,29.21 D2.1 | JP9.2 69.85,19.05 JP5.4 | C17.1 C2.1 | 67.43,29.21 67.43,30.78 R3.2 65.41,30.9 | C2.1 62.45,30.9 61.59,31.75 60.24,31.75 U2.6 | C2.1 65.41,30.9 | R17.2 76.2,24.77 v76.83,25.4 | v81.92,32.7 82.31,32.7 IC2.8 | 65.09,31.22 65.41,30.9 | R8.2 21.17,23.39 | 21.17,23.39 21.91,24.13 21.91,26.67 24.13,28.89 25.87,28.89 U$5.3 | 21.17,23.39 20.85,23.71 R11.2 14.92,24.03 v14.92,25.4 | IC1.8 v4.45,29.84
  Top 0.61: C16.A 31.03,28.79 C18.1 36.83,28.79 | 36.83,28.79 38.53,28.79 L1.1 | 36.83,28.79 36.83,36.83 38.1,38.1 J1.2 40.64,38.73 41.91,40.01 63.82,40.01 65.09,38.73 65.09,31.22
  Bottom 0.406: v68.9,29.21 69.22,28.89 69.22,21.27 70.17,20.32 JP5.4 71.75,20.32 v76.83,25.4 81.28,25.4 81.92,26.04 v81.92,32.7 | v4.45,29.84 4.45,26.99 6.03,25.4 v14.92,25.4
  pour Top (isolate 0.254, no thermals): 22.86,28.26 33.02,28.26 33.02,30.48 22.86,30.48
VDIV-A  (via drill 0.5)
  Top 0.305: R20.1 R21.2 50.59,15.88 v50.8,15.88 | U2.23 50.7,28.48 50.16,27.94 50.16,26.99 v50.8,26.35
  Bottom 0.305: v50.8,26.35 v50.8,15.88
VIN  (via drill 0.5)
  Bottom 0.813: C13.1 24.55,36.83 U$3.3
  other vias: 23.5,22.23 24.77,22.23 26.04,22.23 23.5,20.95 24.77,20.95 26.04,20.95 21.59,35.56 22.86,35.56 24.13,35.56
  pour Top (isolate 0.254, no thermals): 26.99,17.14 26.99,25.08 22.86,25.08 22.86,17.14
  pour Top (isolate 0.254, no thermals): 20.32,39.69 25.08,39.69 25.08,31.11 20.32,31.11
  pour Bottom (isolate 0.254, no thermals): 20.32,39.69 25.08,39.69 25.08,31.11 25.08,26.99 26.99,25.08 26.99,20 22.86,20 22.86,28.57 20.32,31.11

### Text on the board
tDocu: Brushless Motor | BlueRobotics | GND | Monitoring Board | STAT | RESET | IND. POWER + | IND. POWER - | rev. 1a | - | + | ~ | ADC6 | TX | ADC7 | RX | 5V | GND | POWER | MOTOR A | PWM A | PWM B | MOTOR B | ESC A+ | ESC B+ | SDA | SCL | GND | - | - | NC | NC | PWR+ | PWR GND | ~ | ESC A- | ESC B- | ~
bDocu: BlueRobotics | Brushless Motor | Monitoring Board | rev. 1 | May 2014 | Designed by R. Jehangir